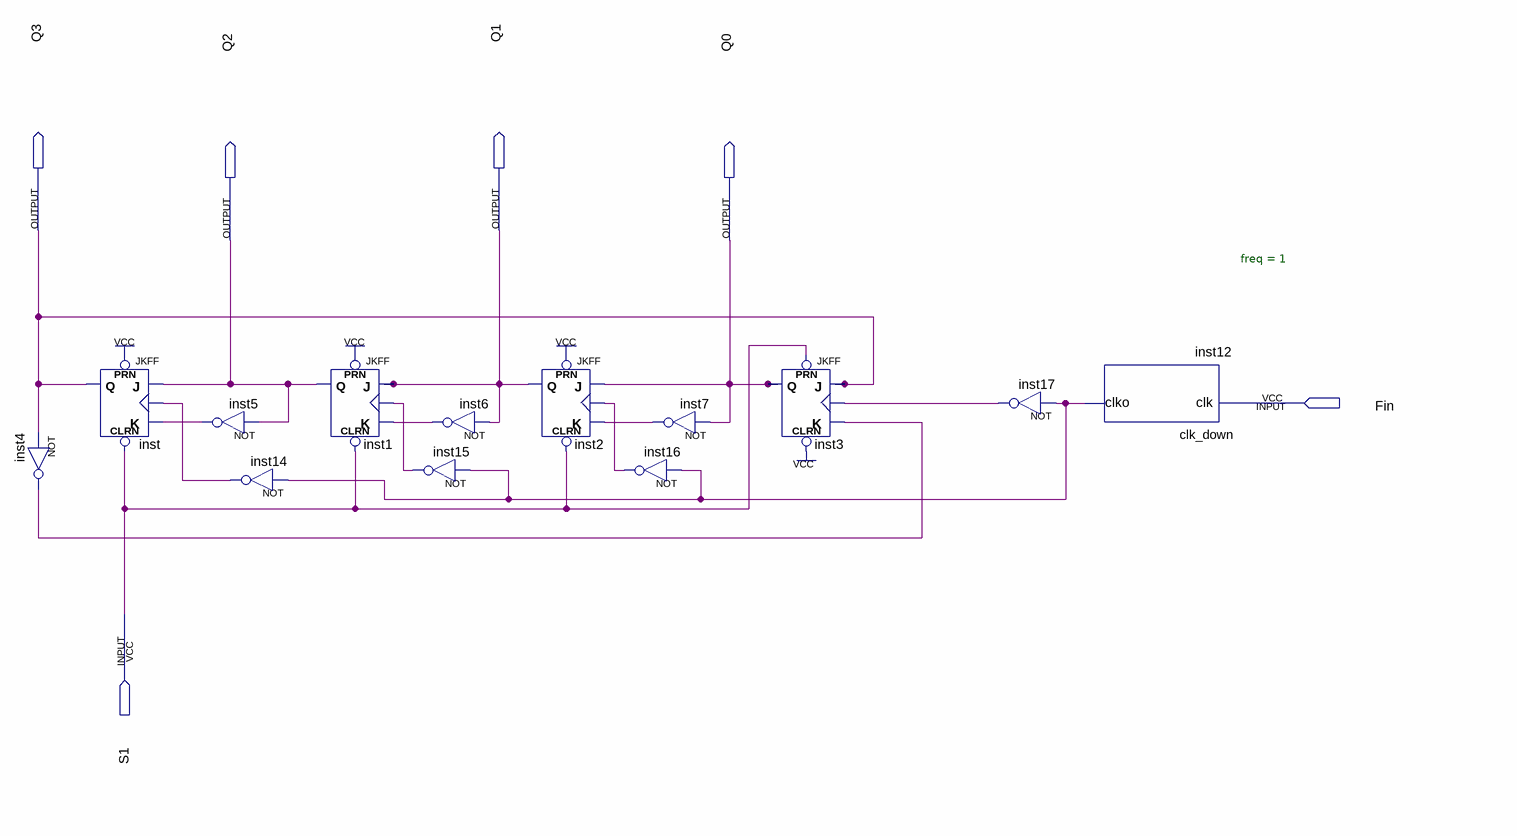
[diagram p0: schematic sheet]
// Quartus schematic binary up counter.bdf as structural Verilog: 13 symbols, 6 pins
module \binary_up_counter  (
  input  Fin,
  input  S1,
  output Q3,
  output Q1,
  output Q2,
  output Q0
);

  wire inst4_out, inst5_out, inst6_out, inst7_out, inst12_clko, inst14_out, inst15_out, inst16_out,
       inst17_out;

  not inst4 (inst4_out, Q3);
  JKFF inst (.PRN(1'b1), .CLRN(S1), .K(inst5_out), .J(Q2), .CLK(inst14_out), .Q(Q3));
  not inst5 (inst5_out, Q2);
  not inst14 (inst14_out, inst12_clko);
  JKFF inst1 (.PRN(1'b1), .CLRN(S1), .K(inst6_out), .J(Q1), .CLK(inst15_out), .Q(Q2));
  not inst6 (inst6_out, Q1);
  not inst15 (inst15_out, inst12_clko);
  JKFF inst2 (.PRN(1'b1), .CLRN(S1), .K(inst7_out), .J(Q0), .CLK(inst16_out), .Q(Q1));
  not inst7 (inst7_out, Q0);
  not inst16 (inst16_out, inst12_clko);
  JKFF inst3 (.PRN(S1), .CLRN(1'b1), .K(inst4_out), .J(Q3), .CLK(inst17_out), .Q(Q0));
  not inst17 (inst17_out, inst12_clko);
  clk_down #(.freq(1)) inst12 (.clk(Fin), .clko(inst12_clko));
endmodule
